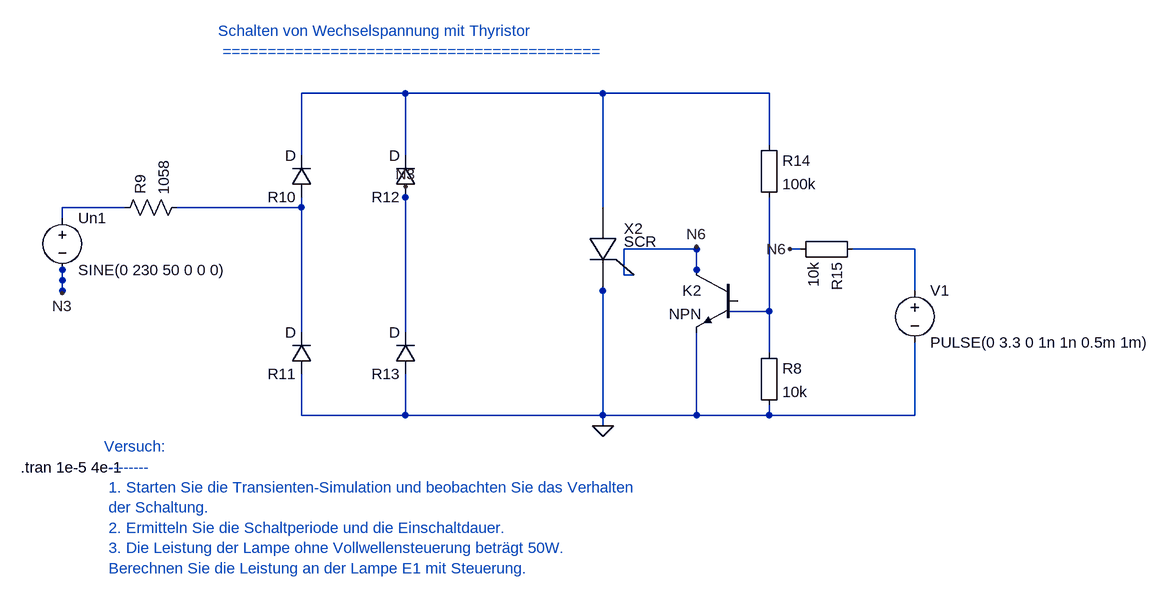
[diagram p0: schematic 11_2_3_Nullspannungsschalter_mit_Thyristor (1).asc]
11_2_3_Nullspannungsschalter_mit_Thyristor (1).asc, the LTspice schematic file:
Version 4
SHEET 1 880 680
WIRE 304 368 320 368
WIRE 128 464 128 480
WIRE 496 288 496 256
WIRE 496 560 496 528
WIRE 656 288 656 256
WIRE 656 560 656 528
WIRE 1168 512 1152 512
WIRE 1152 512 1152 528
WIRE 1104 560 1104 592
WIRE 1440 576 1440 592
WIRE 1008 472 992 472
WIRE 992 472 992 432
WIRE 960 496 960 464
WIRE 496 256 496 192
WIRE 496 192 656 192
WIRE 656 192 960 192
WIRE 656 256 656 192
WIRE 496 352 496 368
WIRE 656 352 656 496
WIRE 496 624 496 688
WIRE 496 688 656 688
WIRE 656 688 960 688
WIRE 656 624 656 688
WIRE 128 384 128 368
WIRE 128 368 224 368
WIRE 496 368 496 528
WIRE 320 368 496 368
WIRE 656 496 656 528
WIRE 128 480 128 496
WIRE 960 704 960 688
WIRE 1216 592 1216 528
WIRE 1216 672 1216 688
WIRE 1104 688 960 688
WIRE 1104 592 1104 688
WIRE 1104 464 1104 432
WIRE 1216 528 1152 528
WIRE 1216 352 1216 528
WIRE 1216 688 1104 688
WIRE 1440 592 1440 688
WIRE 1440 688 1216 688
WIRE 1440 496 1440 432
WIRE 1440 432 1344 432
WIRE 960 192 1216 192
WIRE 1216 192 1216 272
WIRE 960 368 960 192
WIRE 960 464 960 688
WIRE 992 432 1104 432
WIRE 656 352 656 336
WIRE 128 464 128 500
WIRE 1104 464 1104 428
WIRE 1264 432 1248 432
FLAG 960 704 0
FLAG 656 336 N3
FLAG 128 500 N3
FLAG 1104 428 N6
FLAG 1248 432 N6
SYMBOL Misc\EuropeanResistor 1200 576 R0
SYMATTR InstName R8
SYMATTR Value 10k
SYMBOL res 208 384 R270
SYMATTR InstName R9
SYMATTR Value 1058
SYMBOL voltage 128 368 R0
SYMATTR InstName Un1
SYMATTR Value SINE(0 230 50 0 0 0)
SYMBOL diode 512 352 R180
SYMATTR InstName R10
SYMATTR Value D
SYMBOL diode 512 624 R180
SYMATTR InstName R11
SYMATTR Value D
SYMBOL diode 672 352 R180
SYMATTR InstName R12
SYMATTR Value D
SYMBOL diode 672 624 R180
SYMATTR InstName R13
SYMATTR Value D
SYMBOL npn 1168 464 M0
SYMATTR InstName K2
SYMATTR Value NPN
SYMBOL Misc\EuropeanResistor 1200 256 R0
SYMATTR InstName R14
SYMATTR Value 100k
SYMBOL Misc\EuropeanResistor 1360 416 R90
SYMATTR InstName R15
SYMATTR Value 10k
SYMBOL voltage 1440 480 R0
SYMATTR InstName V1
SYMATTR Value PULSE(0 3.3 0 1n 1n 0.5m 1m)
SYMBOL SCR 960 432 R0
SYMATTR InstName X2
SYMATTR Prefix X
SYMATTR SpiceModel SCR
TEXT 64 768 Left 2 !.tran 1e-5 4e-1
TEXT 368 96 Left 2 ;Schalten von Wechselspannung mit Thyristor \n ==========================================
TEXT 192 736 Left 2 ;Versuch: \n -------- \n 1. Starten Sie die Transienten-Simulation und beobachten Sie das Verhalten \n der Schaltung. \n 2. Ermitteln Sie die Schaltperiode und die Einschaltdauer. \n 3. Die Leistung der Lampe ohne Vollwellensteuerung beträgt 50W. \n Berechnen Sie die Leistung an der Lampe E1 mit Steuerung.

The netlist it stands for:
* 11_2_3_Nullspannungsschalter_mit_Thyristor (1).asc
R8 N003 0 10k
R9 N004 N001 1058
V§Un1 N004 N3 SINE(0 230 50 0 0 0)
D§R10 N001 N002 D
D§R11 0 N001 D
D§R12 N3 N002 D
D§R13 0 N3 D
Q§K2 N6 N003 0 0 NPN
R14 N002 N003 100k
R15 N005 N6 10k
V1 N005 0 PULSE(0 3.3 0 1n 1n 0.5m 1m)
XX2 N002 N6 0 SCR SCR  ; pins A G K
.model D D
.lib standard.dio
.model NPN NPN
.model PNP PNP
.lib standard.bjt
.tran 1e-5 4e-1
* Schalten von Wechselspannung mit Thyristor
*  ==========================================
* Versuch:
*  --------
*  1. Starten Sie die Transienten-Simulation und beobachten Sie das Verhalten
*  der Schaltung.
*  2. Ermitteln Sie die Schaltperiode und die Einschaltdauer.
*  3. Die Leistung der Lampe ohne Vollwellensteuerung beträgt 50W.
*  Berechnen Sie die Leistung an der Lampe E1 mit Steuerung.
.backanno
.end